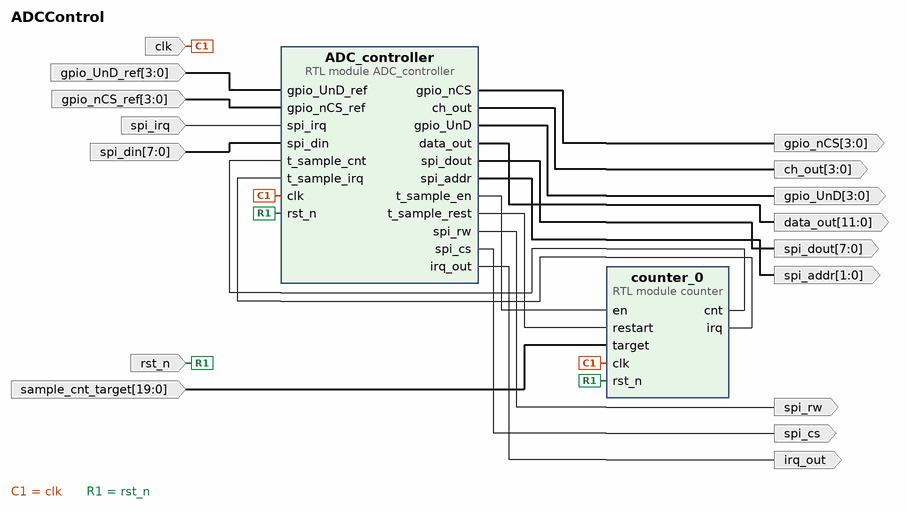
[diagram p0: block diagram of the top level]
# Vivado block design ADCControl, xczu3eg-sbva484-1-i, Vivado 2020.2
create_bd_design ADCControl

create_bd_port -dir I -type clk clk
create_bd_port -dir I -type rst rst_n
create_bd_port -dir I -from 3 -to 0 gpio_UnD_ref
create_bd_port -dir I -from 3 -to 0 gpio_nCS_ref
create_bd_port -dir I -type intr spi_irq
create_bd_port -dir I -from 7 -to 0 spi_din
create_bd_port -dir O -from 3 -to 0 gpio_nCS
create_bd_port -dir O -from 7 -to 0 spi_dout
create_bd_port -dir O spi_rw
create_bd_port -dir O -from 3 -to 0 gpio_UnD
create_bd_port -dir O -from 3 -to 0 ch_out
create_bd_port -dir O spi_cs
create_bd_port -dir O -from 1 -to 0 spi_addr
create_bd_port -dir O -from 11 -to 0 data_out
create_bd_port -dir O irq_out
create_bd_port -dir I -from 19 -to 0 sample_cnt_target

create_bd_cell -type module -reference counter counter_0
set_property -dict {CONFIG.n_bits 20} [get_bd_cells counter_0]
create_bd_cell -type module -reference ADC_controller ADC_controller

# ---- connections ----

connect_bd_net -net clka_0_1 [get_bd_ports clk] [get_bd_pins counter_0/clk] [get_bd_pins ADC_controller/clk]
connect_bd_net -net rst_n_0_1 [get_bd_ports rst_n] [get_bd_pins counter_0/rst_n] [get_bd_pins ADC_controller/rst_n]
connect_bd_net -net gpio_UnD_ref_0_1 [get_bd_ports gpio_UnD_ref] [get_bd_pins ADC_controller/gpio_UnD_ref]
connect_bd_net -net gpio_nCS_ref_0_1 [get_bd_ports gpio_nCS_ref] [get_bd_pins ADC_controller/gpio_nCS_ref]
connect_bd_net -net spi_irq_0_1 [get_bd_ports spi_irq] [get_bd_pins ADC_controller/spi_irq]
connect_bd_net -net spi_din_0_1 [get_bd_ports spi_din] [get_bd_pins ADC_controller/spi_din]
connect_bd_net -net ADC_controller_0_gpio_nCS [get_bd_pins ADC_controller/gpio_nCS] [get_bd_ports gpio_nCS]
connect_bd_net -net ADC_controller_0_spi_dout [get_bd_pins ADC_controller/spi_dout] [get_bd_ports spi_dout]
connect_bd_net -net ADC_controller_0_spi_rw [get_bd_pins ADC_controller/spi_rw] [get_bd_ports spi_rw]
connect_bd_net -net ADC_controller_0_gpio_UnD [get_bd_pins ADC_controller/gpio_UnD] [get_bd_ports gpio_UnD]
connect_bd_net -net ADC_controller_0_ch_out [get_bd_pins ADC_controller/ch_out] [get_bd_ports ch_out]
connect_bd_net -net ADC_controller_0_spi_cs [get_bd_pins ADC_controller/spi_cs] [get_bd_ports spi_cs]
connect_bd_net -net ADC_controller_0_spi_addr [get_bd_pins ADC_controller/spi_addr] [get_bd_ports spi_addr]
connect_bd_net -net ADC_controller_0_data_out [get_bd_pins ADC_controller/data_out] [get_bd_ports data_out]
connect_bd_net -net ADC_controller_0_irq_out [get_bd_pins ADC_controller/irq_out] [get_bd_ports irq_out]
connect_bd_net [get_bd_pins ADC_controller/t_sample_en] [get_bd_pins counter_0/en]
connect_bd_net [get_bd_pins ADC_controller/t_sample_rest] [get_bd_pins counter_0/restart]
connect_bd_net [get_bd_pins counter_0/cnt] [get_bd_pins ADC_controller/t_sample_cnt]
connect_bd_net [get_bd_pins counter_0/irq] [get_bd_pins ADC_controller/t_sample_irq]
connect_bd_net -net target_0_1 [get_bd_ports sample_cnt_target] [get_bd_pins counter_0/target]

validate_bd_design
save_bd_design
